# Altium schematic sheet MCU.SchDoc
size A; Engineer: Will Snyder; Revision: 1.0; SheetNumber: 3; SheetTotal: 5; DocumentTitle: MCU
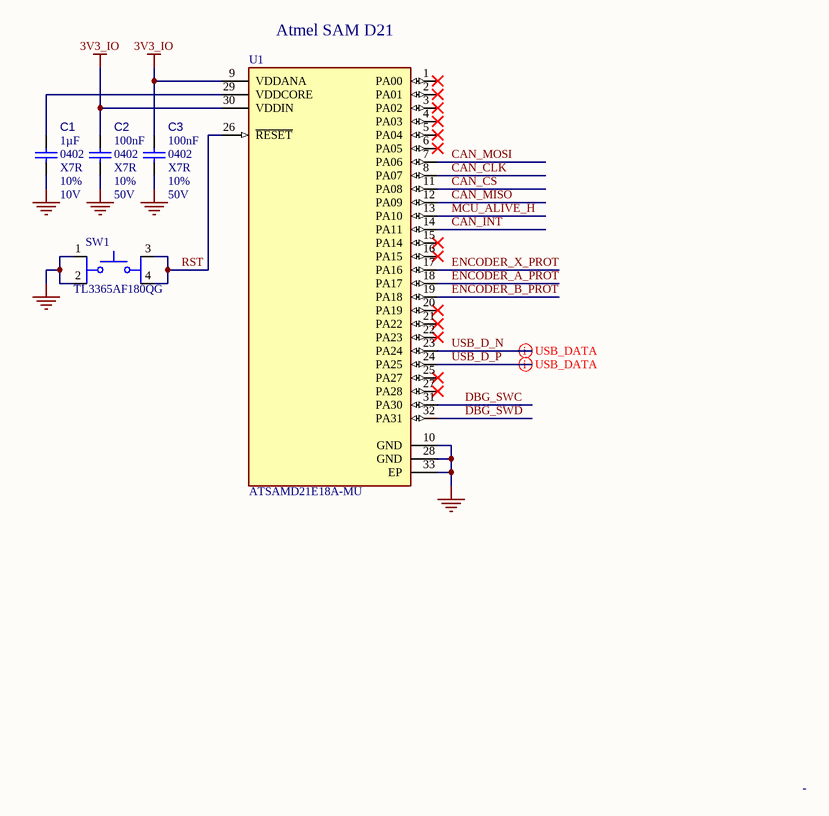
[diagram p0: MCU.SchDoc]

## Parts
C1  value 1µF  Case/Package: 0402  Voltage Rating: 10V  Capacitor Type: X7R  Tolerance: 10%  [CAPC1005X55X30NL05T10]  (hidden comment: GRM155Z71A105KE01D)
C2  value 100nF  Voltage Rating: 50V  Capacitor Type: X7R  Case/Package: 0402  Tolerance: 10%  [CAPC1005X55X30NL05T10]  (hidden comment: 04025C104KAT4A)
C3  value 100nF  Voltage Rating: 50V  Capacitor Type: X7R  Case/Package: 0402  Tolerance: 10%  [CAPC1005X55X30NL05T10]  (hidden comment: 04025C104KAT4A)
SW1  TL3365AF180QG  [SW_TL3365AF180QG]
U1  ATSAMD21E18A-MU  [FP-PG-IPC_A]

## Nets
3V3_IO: C2.1 C3.1 U1.9(VDDANA) U1.30(VDDIN)
GND: C1.2 C2.2 C3.2 SW1.1 SW1.2 U1.10(GND) U1.28(GND) U1.33(EP)
CAN_CLK: U1.8(PA07)
CAN_CS: U1.11(PA08)
CAN_INT: U1.14(PA11)
CAN_MISO: U1.12(PA09)
CAN_MOSI: U1.7(PA06)
DBG_SWC: U1.31(PA30)
DBG_SWD: U1.32(PA31)
ENCODER_A_PROT: U1.18(PA17)
ENCODER_B_PROT: U1.19(PA18)
ENCODER_X_PROT: U1.17(PA16)
MCU_ALIVE_H: U1.13(PA10)
RST: SW1.3 SW1.4 U1.26(~{RESET})
USB_D_N: U1.23(PA24)
USB_D_P: U1.24(PA25)
NetC1_1: C1.1 U1.29(VDDCORE)

Not connected (* = marked no-connect by the designer): U1 1(PA00)* 2(PA01)* 3(PA02)* 4(PA03)* 5(PA04)* 6(PA05)* 15(PA14)* 16(PA15)* 20(PA19)* 21(PA22)* 22(PA23)* 25(PA27)* 27(PA28)*

## Layout directives
differential pair: USB_D_N, USB_D_P

## Notes on the sheet
- (near U1) Atmel SAM D21
- -

## Library data of the parts
C1 = CMP-001-00092-1: Ceramic Capacitor, Multilayer, Ceramic, 10V, 10% +Tol, 10% -Tol, X7R, 15% TC, 1uF, Surface Mount, 0402; Mounting Technology: Surface Mount; Max Operating Temperature: 125°C; Pins: 2; RoHS Compliant: Yes; Min Operating Temperature: -55°C
C2 C3 = CMP-001-00090-1: Ceramic Capacitor, Multilayer, Ceramic, 50V, 10% +Tol, 10% -Tol, X7R, 15% TC, 0.1uF, Surface Mount, 0402; Pins: 2; RoHS Compliant: Yes
SW1 = CMP-011-00019-2: Tactile Switch SPST-NO Top Actuated Surface Mount; MF: E-Switch; MP: TL3365AF180QG; Case/Package: None; Availability: In Stock; SnapEDA_Link: https://www.snapeda.com/parts/TL3365AF180QG/E-Switch/view-part/?ref=snap; Check_prices: https://www.snapeda.com/parts/TL3365AF180QG/E-Switch/view-part/?ref=eda; Value: *; Pins: 4; Price: None; Purchase-URL: https://pricing.snapeda.com/search/part/TL3365AF180QG/?ref=eda; Component Type: Standard; Design Item ID: TL3365AF180QG; Source: TL3365AF180QG.SchLib
U1 = CMP-020-00023-1: RISC Microcontroller, 32-Bit, FLASH, CORTEX-M0 CPU, 48MHz, CMOS; Max Supply Voltage: 3.63V; Clock Frequency: 32MHz; Min Supply Voltage: 1.62V; Nominal Supply Voltage: 3.3V; RoHS Compliant: Yes; Max Operating Temperature: 85°C; Pins: 32; Case/Package: HVQCCN; Min Operating Temperature: -40°C